# Altium schematic sheet 01_BLOCK_DIAGRAM.SchDoc: =title
size A3; Organization: 阿米诺技术; Address4: www.amenuo.com; Revision: 1.0; SheetNumber: 1; SheetTotal: 23; Rule: 1.0
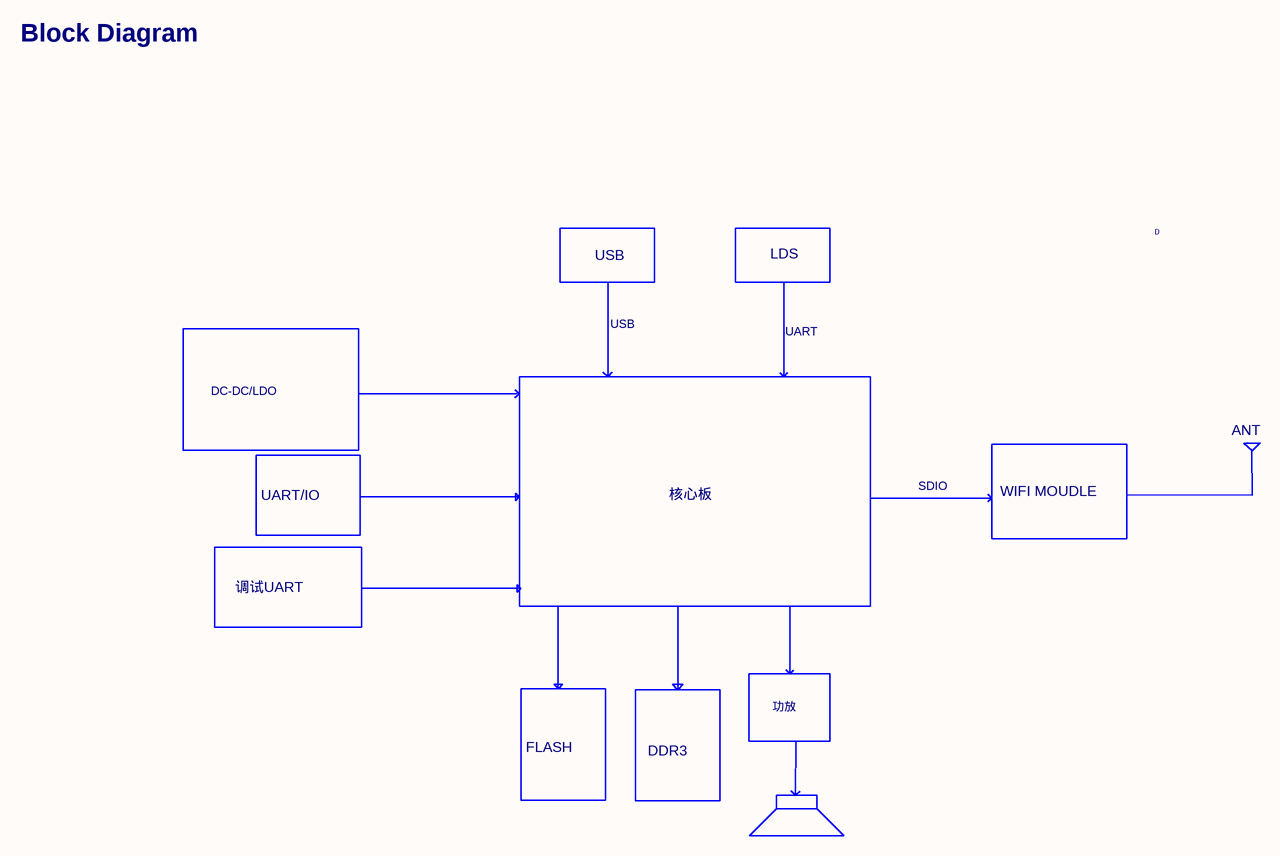
[diagram p0: 01_BLOCK_DIAGRAM.SchDoc]

## Notes on the sheet
- Block Diagram
- D
- USB
- LDS
- UART
- DC-DC/LDO
- ANT
- UART/IO
- 核心板
- SDIO
- WIFI MOUDLE
- 调试UART
- 功放
- FLASH
- DDR3
- Title
- Size:
- Date:
- A3
- Engineer:
- Time:
- Revision:
- Sheet
- of
- File: